# EAGLE design mp28164-buck-boost-flashlight-driver-tester-mk-1.0.0.opamp.only (EAGLE 9.2.2)
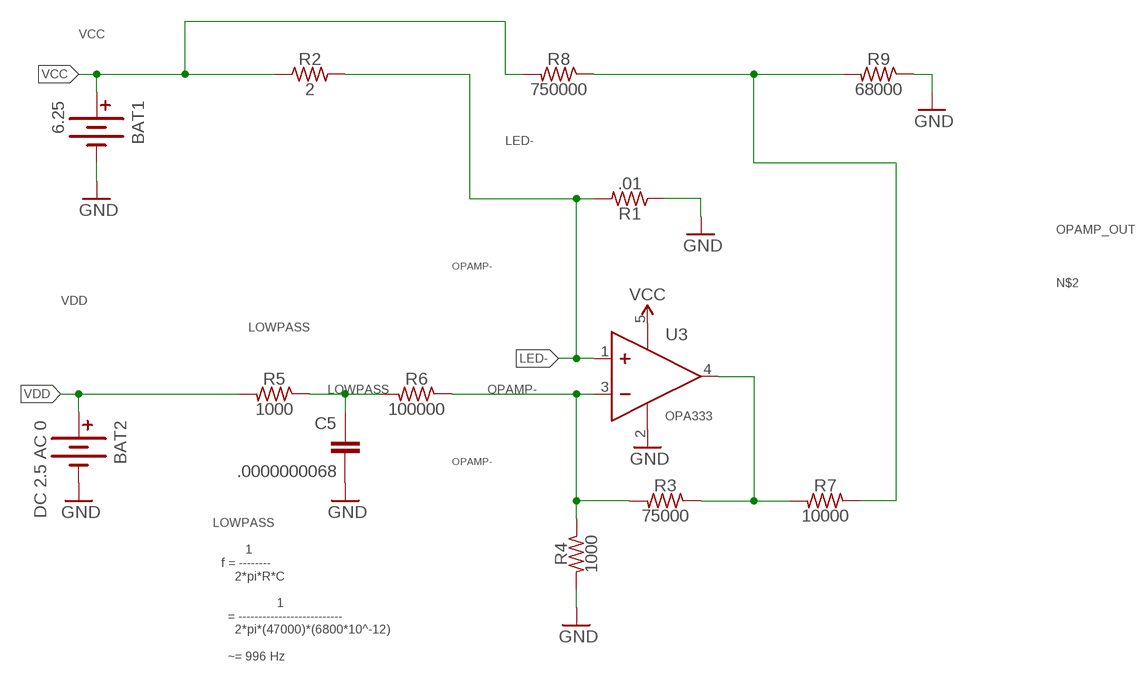
[diagram p0: schematic, sheet 1]

## Parts
BAT1  6.25  BATTERY9V  [BATTCON_9V]
BAT2  DC 2.5 AC 0  BATTERY9V  [BATTCON_9V]
C5  .0000000068  CAPACITOR-CERAMICC0402  [C0402]
R1  .01  RESISTORR0805-TIGHTER  [R0805-TIGHTER]
R2  2  RESISTOR0204/2V  [0204V]
R3  75000  RESISTORR0402  [R0402]
R4  1000  RESISTORR0402  [R0402]
R5  1000  RESISTORR0402  [R0402]
R6  100000  RESISTORR0402  [R0402]
R7  10000  RESISTORR0402  [R0402]
R8  750000  RESISTORR0402  [R0402]
R9  68000  RESISTORR0402  [R0402]
U3  OPA333  OPAMPOPA333-SC-70  [SC70]

## Nets
GND: BAT1.- BAT2.- C5.2 R1.1 R4.2 R9.1 U3.2(V-)
LED-: R1.2 R2.2 U3.1(IN+)
LOWPASS: C5.1 R5.1 R6.2
N$2: R7.1 R8.1 R9.2
OPAMP-: R3.2 R4.1 R6.1 U3.3(IN-)
OPAMP_OUT: R3.1 R7.2 U3.4(OUT)
VCC: BAT1.+ R2.1 R8.2 U3.5(V+)
VDD: BAT2.+ R5.2

## Notes on the sheet
- 1
  f = --------
      2*pi*R*C
  
                  1
    = --------------------------
      2*pi*(47000)*(6800*10^-12)
  
    ~= 996 Hz

## Library data of the parts
BAT1 BAT2 = a_parts:BATTERY: Battery Holders Various common sizes : AA, AAA, 20mm coin cell and 12mm coin cell. 20MM_4LEGS, BATT-10373; SPICEPREFIX: V
C5 = a_parts:CAPACITOR-CERAMIC: CAPACITOR, European symbol; SPICEPREFIX: C
R1-R9 = a_parts:RESISTOR: RESISTOR, American symbol; SPICEPREFIX: R
U3 = a_parts:OPAMP; SPICEMODEL: OPAMP; SPICEPREFIX: X

## Board
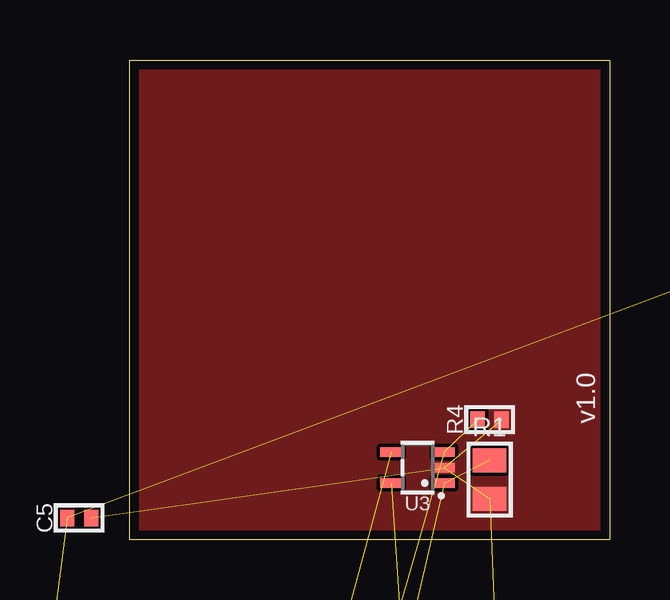
[diagram p1: board, top side]
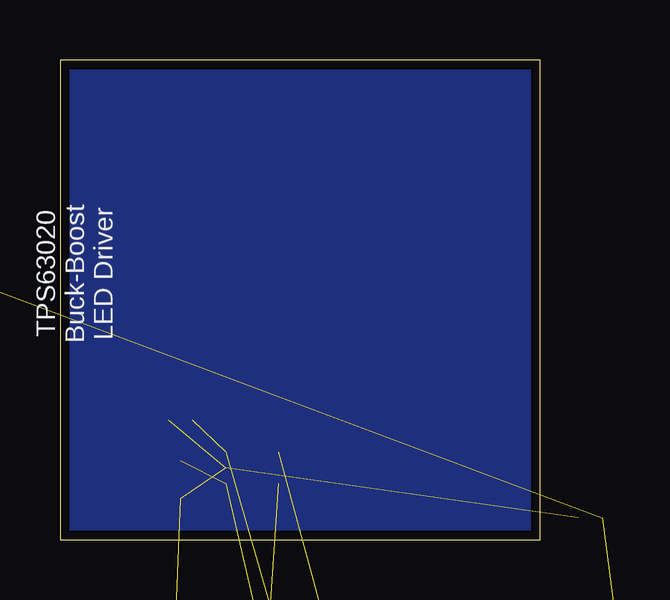
[diagram p2: board, bottom side, seen from below]

Size 20 x 20 mm. Coordinates in mm from the lower left corner, seen from the top.
Outline: 0,20 20,20 20,0 0,0 0,20
Copper layers (1*16): Top 0.035559375mm / dielectric 1.6mm / Bottom 0.035559375mm
Design rules "oshpark-2layer": minimum track width 6mil, minimum drill 10mil, track to track 6mil, track to pad 6mil, pad to pad 6mil, via to via 6mil, smd to smd 0mil, copper to edge 15mil, drill to drill 6mil, minimum pad ring 5mil, minimum via ring 5mil, stop-mask expansion 2.5mil, vias tented up to drill 20mil, thermal gap 10mil

### Footprints (pad centres in the part's own frame; a part is rotated, then mirrored left to right if it is on the bottom)
BATTCON_9V = drill 1.905: + 0,0; - 0,-12.954
C0402 = smd 0.6 x 0.7: 1 -0.5,0; 2 0.5,0
R0805-TIGHTER = smd 1 x 1.4: 1 -0.8,0; 2 0.8,0
0204V = drill 0.813 octagon: 1 -1.27,0; 2 1.27,0
R0402 = smd 0.6 x 0.7: 1 -0.5,0; 2 0.5,0
SC70 = smd 0.4 x 0.9: 1 -0.65,-1.1; 2 0,-1.1; 3 0.65,-1.1; 4 0.65,1.1; 5 -0.65,1.1

### Placement (x,y rotation side)
BAT1  22.4,-169.6 0 top  (outside the outline)
BAT2  22.4,-199.9 0 top  (outside the outline)
C5  -2.1,0.9 0 top
R1  15,2.5 90 top
R2  -49.5,-262.6 0 top  (outside the outline)
R3  -8.3,-69 0 top  (outside the outline)
R4  15,5 0 top
R5  29.4,13.1 180 top  (outside the outline)
R6  -31.8,-219.5 0 top  (outside the outline)
R7  -14.5,-68.1 0 top  (outside the outline)
R8  -34.9,-219.5 0 top  (outside the outline)
R9  -38,-219.5 0 top  (outside the outline)
U3  12,3 90 top

### Tracks (layer width: path | path; a pad name or v marks a point on that pad's centre or on a via)
GND  (6 unrouted)
  pour Top (rank 2, no thermals): 0,0 20,0 20,20 0,20
  pour Bottom (rank 2, no thermals): 20,0 0,0 0,20 20,20
LED-  (2 unrouted)
LOWPASS  (2 unrouted)
N$2  (2 unrouted)
OPAMP-  (3 unrouted)
OPAMP_OUT  (2 unrouted)
VCC  (3 unrouted)
VDD  (1 unrouted)

### Text on the board
bPlace: TPS63020 / Buck-Boost / LED Driver